# EasyEDA schematic digits_switcher_pcb.json
REV: 1.0; Date: 25-06-2022; Sheet: 1/1; Drawn By: Gustavo Moraes
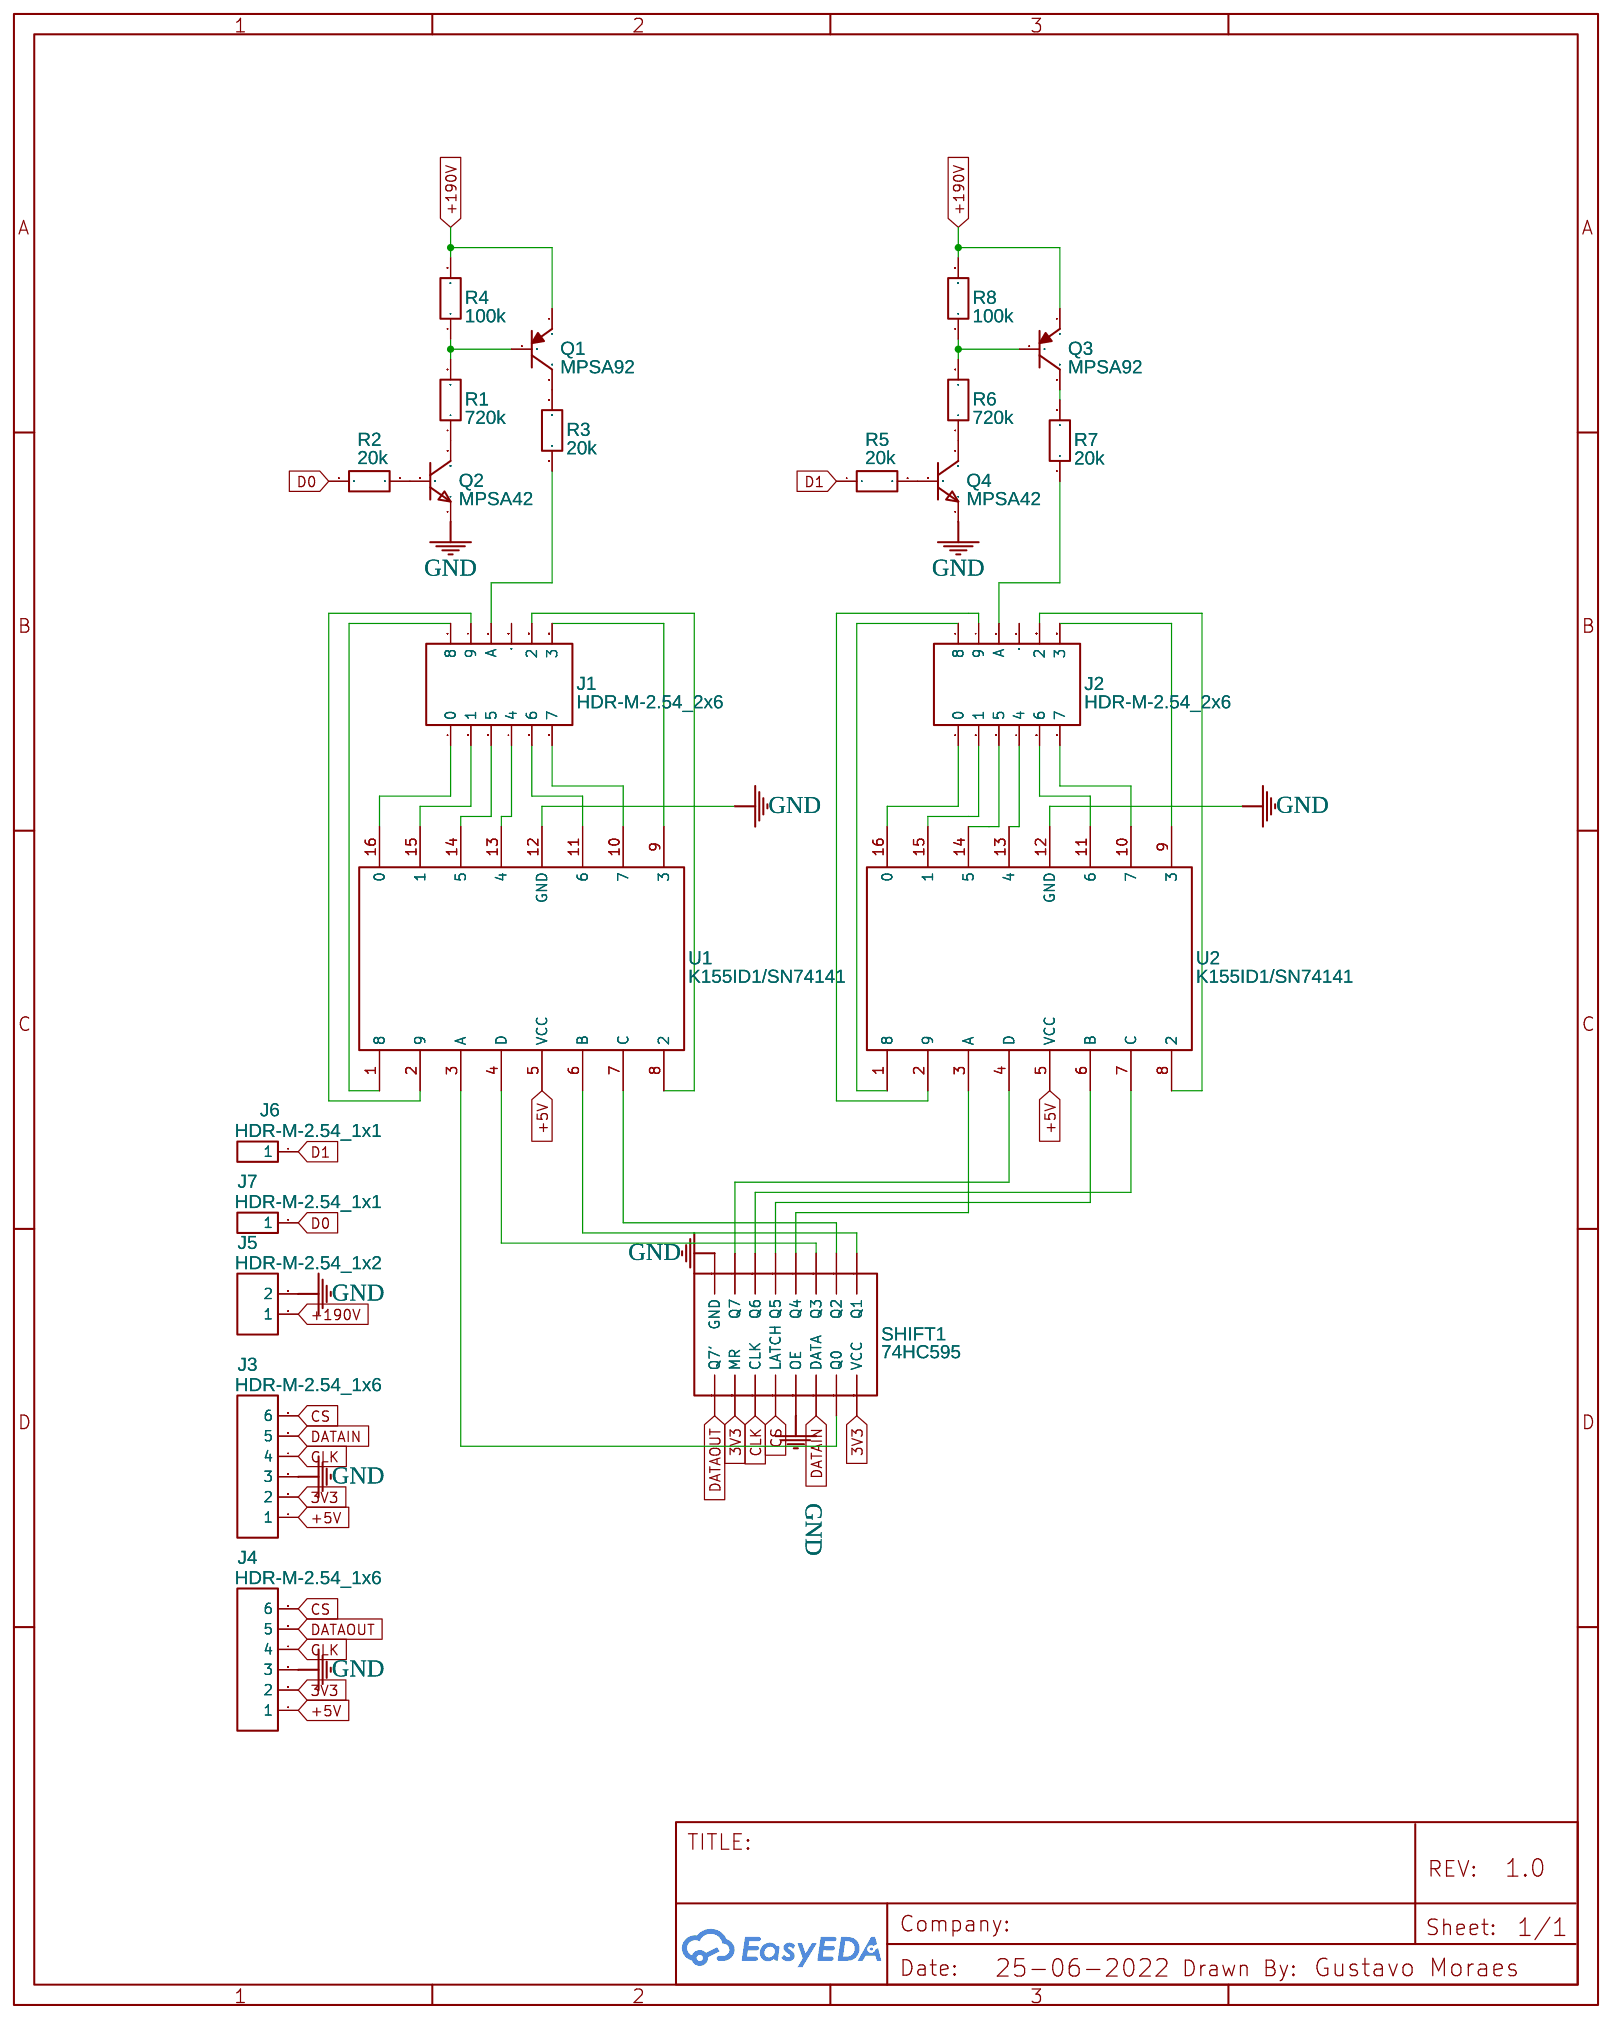
[diagram p0: schematic sheet]

## Parts
J1  HDR-M-2.54_2x6  [HDR-M-2.54_2X6]
J2  HDR-M-2.54_2x6  [HDR-M-2.54_2X6]
J3  HDR-M-2.54_1x6  [HDR-M-2.54_1X6]
J4  HDR-M-2.54_1x6  [HDR-M-2.54_1X6]
J5  HDR-M-2.54_1x2  [HDR-M-2.54_1X2]
J6  HDR-M-2.54_1x1  [HDR-M-2.54_1X1]
J7  HDR-M-2.54_1x1  [HDR-M-2.54_1X1]
Q1  MPSA92  [TO-92-3_L5.1-W4.1-P1.27-L]
Q2  MPSA42  [TO-92-3_L4.9-W3.7-P1.27-L]
Q3  MPSA92  [TO-92-3_L5.1-W4.1-P1.27-L]
Q4  MPSA42  [TO-92-3_L4.9-W3.7-P1.27-L]
R1  720k  [R_AXIAL-0.3]
R2  20k  [R_AXIAL-0.3]
R3  20k  [R_AXIAL-0.3]
R4  100k  [R_AXIAL-0.3]
R5  20k  [R_AXIAL-0.3]
R6  720k  [R_AXIAL-0.3]
R7  20k  [R_AXIAL-0.3]
R8  100k  [R_AXIAL-0.3]
SHIFT1  74HC595  [DIP-16]
U1  K155ID1/SN74141  [DIP16]
U2  K155ID1/SN74141  [DIP16]

## Library data of the parts
J1 = HDR-M-2.54_2x6: Supplier Part: C124388; Supplier: LCSC; Contributor: LCEDA_Lib; Package Display: No
J2 = HDR-M-2.54_2x6: Supplier Part: C124388; Supplier: LCSC; Contributor: LCEDA_Lib
J3 J4 = HDR-M-2.54_1x6: Supplier Part: C190819; Supplier: LCSC; Contributor: LCEDA_Lib
J5 = HDR-M-2.54_1x2: Supplier Part: C124375; Supplier: LCSC; Contributor: LCEDA_Lib
J6 J7 = HDR-M-2.54_1x1: Supplier Part: C81276; Supplier: LCSC; Contributor: LCEDA_Lib
Q1 Q3 = MPSA92: Supplier: LCSC; Manufacturer: SEMTECH; Supplier Part: C118558; JLCPCB Part Class: Extended Part
Q2 Q4 = MPSA42: Supplier: LCSC; Manufacturer: SEMTECH; Contributor: LCSC; Supplier Part: C118557; JLCPCB Part Class: Extended Part
R1-R8 = R_AXIAL-0.3_EU: Contributor: LCEDA_Lib
SHIFT1 = 74HC595: Contributor: prizmi.linek
U1 U2 = K155ID1/SN74141: Contributor: Sjoertdb

## Nets
3V3: J3.2 J4.2 SHIFT1.10(MR) SHIFT1.16(VCC)
+5V: J3.1 J4.1 U1.5(VCC) U2.5(VCC)
+190V: J5.1 Q1.1 Q3.1 R4.2 R8.2
GND: J3.3 J4.3 J5.2 Q2.1(E) Q4.1(E) SHIFT1.8(GND) SHIFT1.13(OE) U1.12(GND) U2.12(GND)
CLK: J3.4 J4.4 SHIFT1.11(CLK)
CS: J3.6 J4.6 SHIFT1.12(LATCH)
D0: J7.1 R2.1
D1: J6.1 R5.1
DATAIN: J3.5 SHIFT1.14(DATA)
DATAOUT: J4.5 SHIFT1.9(Q7')
Net-(J1-1): J1.1(0) U1.16(0)
Net-(J1-2): J1.2(8) U1.1(8)
Net-(J1-3): J1.3(1) U1.15(1)
Net-(J1-4): J1.4(9) U1.2(9)
Net-(J1-5): J1.5 U1.14(5)
Net-(J1-6): J1.6(A) R3.1
Net-(J1-7): J1.7(4) U1.13(4)
Net-(J1-9): J1.9(6) U1.11(6)
Net-(J1-10): J1.10(2) U1.8(2)
Net-(J1-11): J1.11(7) U1.10(7)
Net-(J1-12): J1.12(3) U1.9(3)
Net-(J2-1): J2.1(0) U2.16(0)
Net-(J2-2): J2.2(8) U2.1(8)
Net-(J2-3): J2.3(1) U2.15(1)
Net-(J2-4): J2.4(9) U2.2(9)
Net-(J2-5): J2.5 U2.14(5)
Net-(J2-6): J2.6(A) R7.1
Net-(J2-7): J2.7(4) U2.13(4)
Net-(J2-9): J2.9(6) U2.11(6)
Net-(J2-10): J2.10(2) U2.8(2)
Net-(J2-11): J2.11(7) U2.10(7)
Net-(J2-12): J2.12(3) U2.9(3)
Net-(Q1-2): Q1.2 R1.2 R4.1
Net-(Q1-3): Q1.3 R3.2
Net-(Q2-2): Q2.2(B) R2.2
Net-(Q2-3): Q2.3(C) R1.1
Net-(Q3-2): Q3.2 R6.2 R8.1
Net-(Q3-3): Q3.3 R7.2
Net-(Q4-2): Q4.2(B) R5.2
Net-(Q4-3): Q4.3(C) R6.1
Net-(SHIFT1-1): SHIFT1.1(Q1) U1.6(B)
Net-(SHIFT1-2): SHIFT1.2(Q2) U1.7(C)
Net-(SHIFT1-3): SHIFT1.3(Q3) U1.4(D)
Net-(SHIFT1-4): SHIFT1.4(Q4) U2.3(A)
Net-(SHIFT1-5): SHIFT1.5(Q5) U2.6(B)
Net-(SHIFT1-6): SHIFT1.6(Q6) U2.7(C)
Net-(SHIFT1-7): SHIFT1.7(Q7) U2.4(D)
Net-(SHIFT1-15): SHIFT1.15(Q0) U1.3(A)

Not connected (* = marked no-connect by the designer): J1 8(5); J2 8(5)
